# EAGLE design rotor (EAGLE 9.6.2)
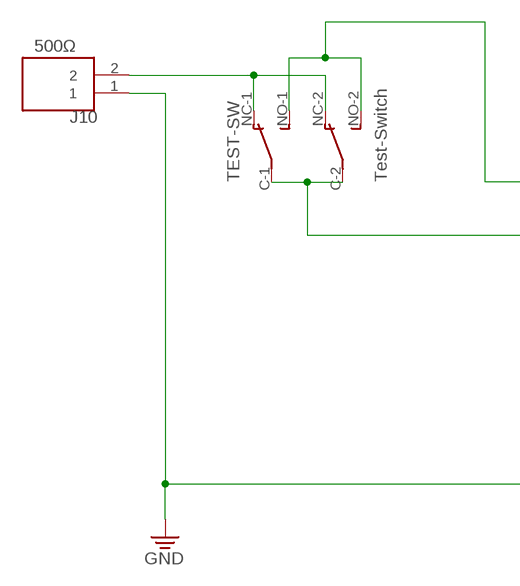
[diagram p0: schematic, sheet 1, part 1 of 2]
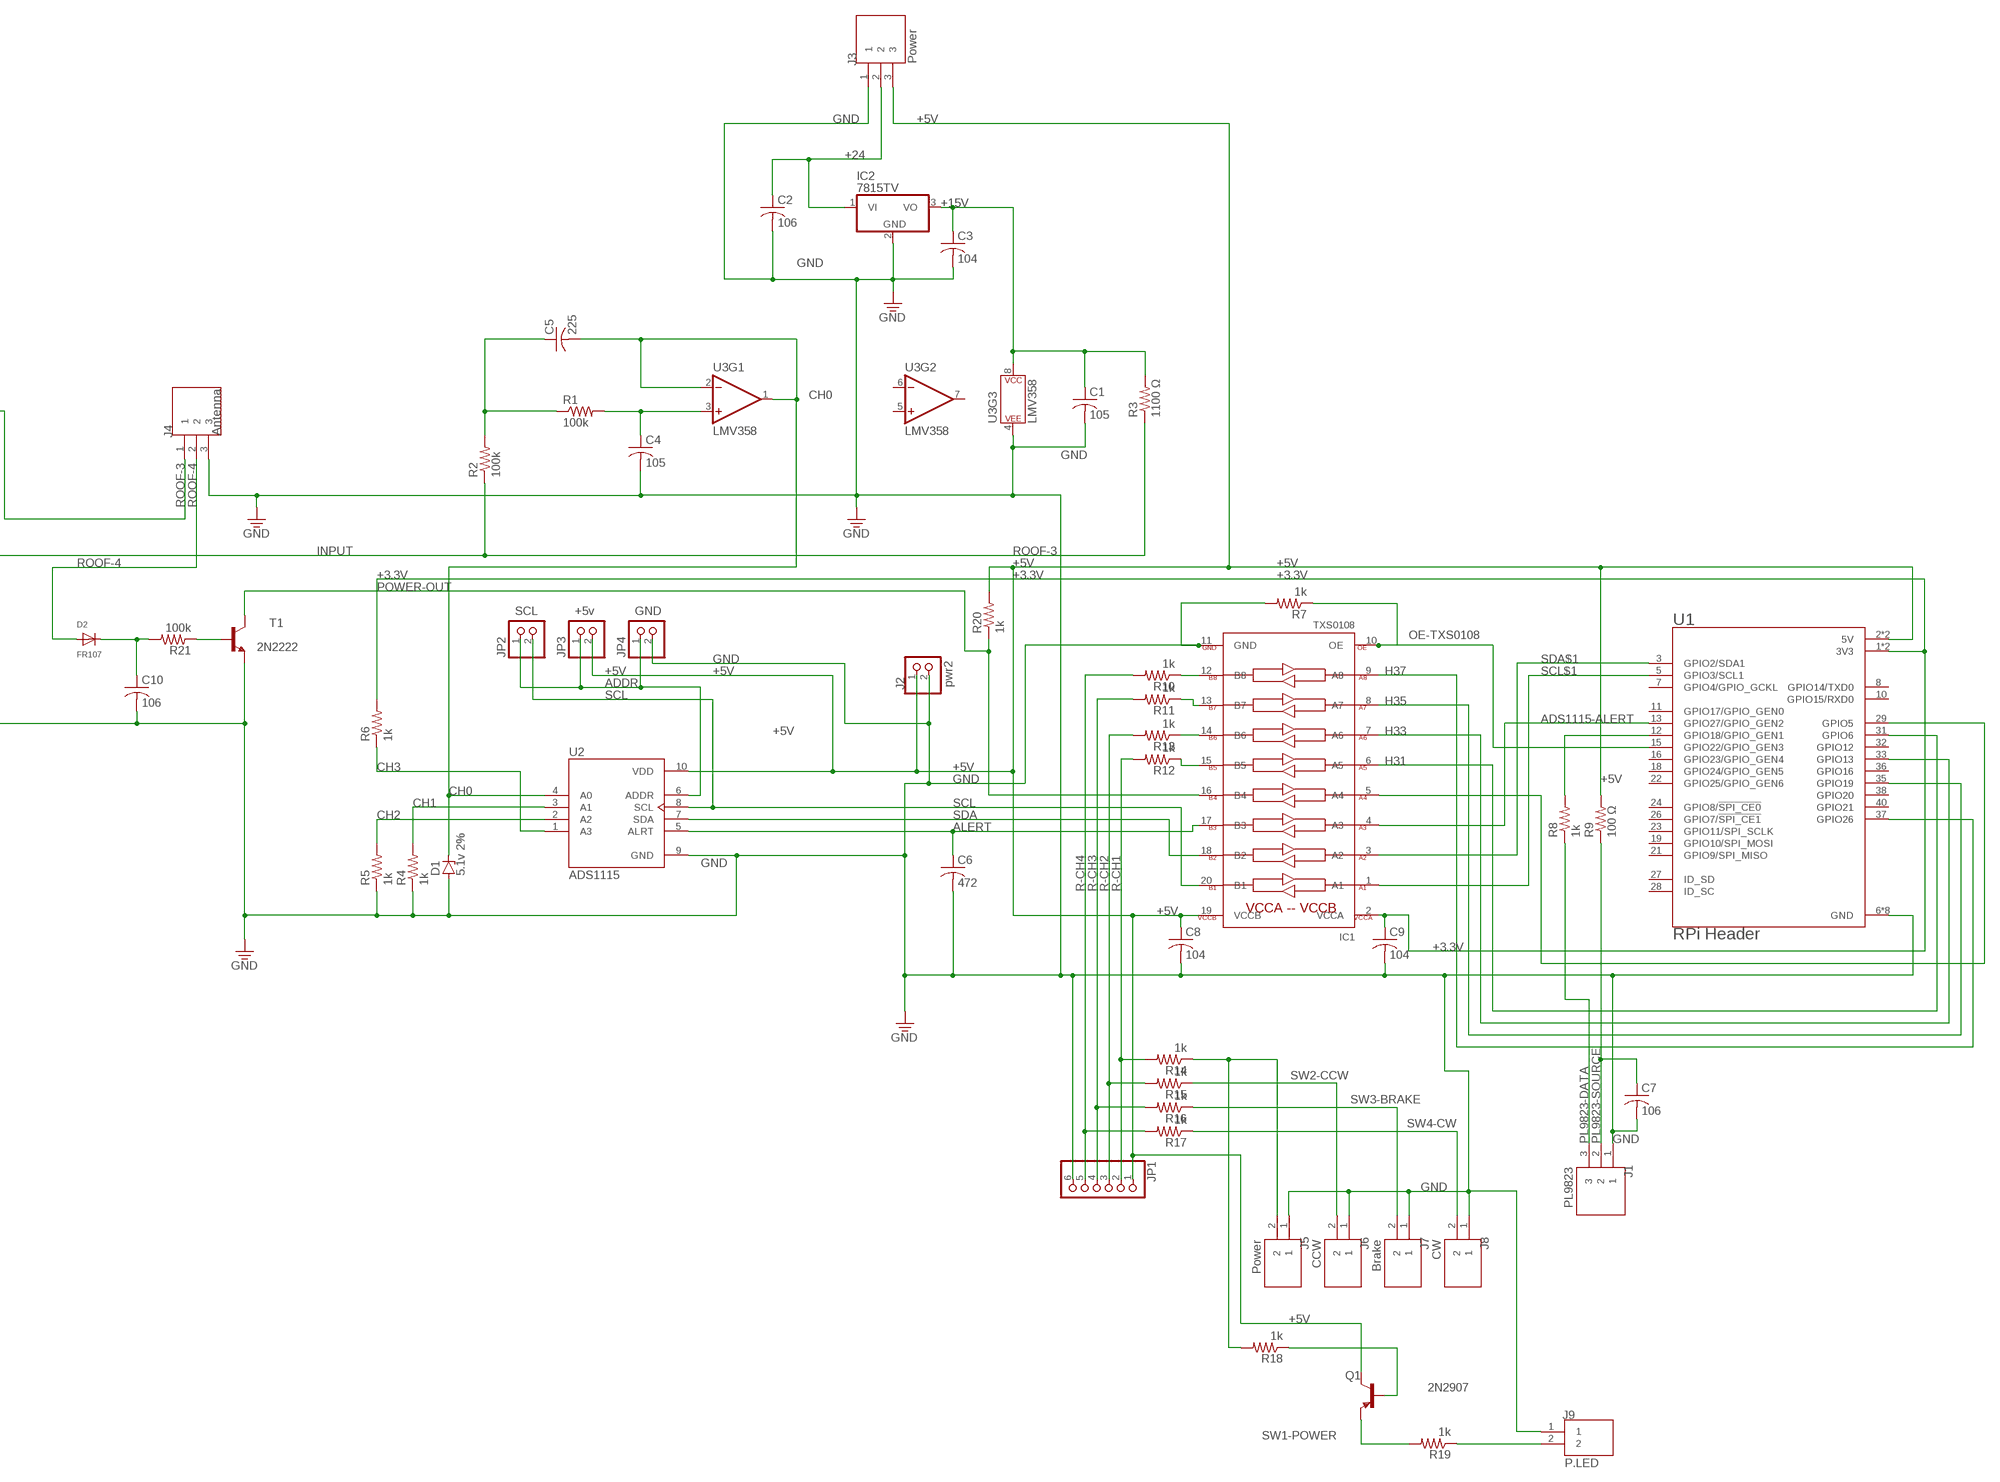
[diagram p1: schematic, sheet 1, part 2 of 2]

## Parts
C1  105  C-USC0805  [C0805]
C2  106  C-USC0805  [C0805]
C3  104  C-USC0805  [C0805]
C4  105  C-USC0805  [C0805]
C5  225  C-USC0805  [C0805]
C6  472  C-USC0805  [C0805]
C7  106  C-USC0805  [C0805]
C8  104  C-USC0805  [C0805]
C9  104  C-USC0805  [C0805]
C10  106  C-USC0805  [C0805]
D1  5.1v 2%  ZENER-DIODEZD-7.5  [ZDIO-7.5]
D2  FR107  DIODESMA  [SMADIODE]
IC1  TXS0108  TXS0108EPWR  [TSSOP20]
IC2  7815TV  [TO220V]
J1  PL9823  TB004-508-03BE  [CUI_TB004-508-03BE]
J2  pwr2  PINHD-1X2  [1X02]
J3  Power  TB004-508-03BE  [CUI_TB004-508-03BE]
J4  Antenna  TB004-508-03BE  [CUI_TB004-508-03BE]
J5  Power  TB004-508-02BE  [CUI_TB004-508-02BE]
J6  CCW  TB004-508-02BE  [CUI_TB004-508-02BE]
J7  Brake  TB004-508-02BE  [CUI_TB004-508-02BE]
J8  CW  TB004-508-02BE  [CUI_TB004-508-02BE]
J9  P.LED  TB004-508-02BE  [CUI_TB004-508-02BE]
J10  500Ω ├  TB004-508-02BE  [CUI_TB004-508-02BE]
JP1  PINHD-1X6  [1X06]
JP2  SCL  PINHD-1X2SPECIAL  [1X02-SPECIAL]
JP3  +5v  PINHD-1X2SPECIAL  [1X02-SPECIAL]
JP4  GND  PINHD-1X2SPECIAL  [1X02-SPECIAL]
Q1  2N2907  2N2907CBE  [TO92-CBE-OVAL]
R1  100k  R-US_M0805  [M0805]
R2  100k  R-US_M0805  [M0805]
R3  1100 Ω  R-US_M0805  [M0805]
R4  1k  R-US_M0805  [M0805]
R5  1k  R-US_M0805  [M0805]
R6  1k  R-US_M0805  [M0805]
R7  1k  R-US_M0805  [M0805]
R8  1k  R-US_M0805  [M0805]
R9  100 Ω  R-US_M0805  [M0805]
R10  1k  R-US_M0805  [M0805]
R11  1k  R-US_M0805  [M0805]
R12  1k  R-US_M0805  [M0805]
R13  1k  R-US_M0805  [M0805]
R14  1k  R-US_M0805  [M0805]
R15  1k  R-US_M0805  [M0805]
R16  1k  R-US_M0805  [M0805]
R17  1k  R-US_M0805  [M0805]
R18  1k  R-US_M0805  [M0805]
R19  1k  R-US_M0805  [M0805]
R20  1k  R-US_M0805  [M0805]
R21  100k  R-US_M0805  [M0805]
T1  2N2222  2N2222CBE  [TO92-CBE-OVAL]
TEST-SW  Test-Switch  DPDT-SWITCH  [DP-DT]
U1  RPi Header  RASPBERRY_PI_3B+_HDRMODEL_RASPBEERY_PI_3B_HDR  [MODULE_RASPBERRY_PI_3B+_HDR]
U2  ADS1115  ADS1115-BREAKOUT-NARROW  [MODULE_1115_NARROW]
U3  LMV358  LM358-SOP8SOIC  [SO08]

## Nets
+3.3V: C9.1 IC1.2(VCCA) R6.2 U1.1(3V3) U1.17(3V3)
+5V: C8.1 IC1.19(VCCB) J2.1 J3.3 JP1.1 JP3.2 Q1.C R9.2 R20.2 U1.2(5V) U1.4(5V) U2.10(VDD)
+15V: C1.1 C3.1 IC2.3(VO) R3.2 U3.8(P$V+)
+24: C2.1 IC2.1(VI) J3.2
ADDR: JP2.1 JP3.1 JP4.1 U2.6(ADDR)
ADS1115-ALERT: IC1.4(A3) U1.13(GPIO27/GPIO_GEN2)
ALERT: C6.1 IC1.17(B3) U2.5(ALRT)
CH0: C5.2 D1.C U2.4(A0) U3.1(OUT) U3.2(-IN)
CH1: R4.2 U2.3(A1)
CH2: R5.2 U2.2(A2)
CH3: R6.1 U2.1(A3)
GND: C1.2 C2.2 C3.2 C4.2 C6.2 C7.2 C8.2 C9.2 C10.2 D1.A IC1.11(GND) IC2.2(GND) J1.1 J2.2 J3.1 J4.3 J5.1 J6.1 J7.1 J8.1 J9.1 J10.1 JP1.6 JP4.2 R4.1 R5.1 R7.2 T1.E U1.6(GND) U1.9(GND) U1.14(GND) U1.20(GND) U1.25(GND) U1.30(GND) U1.34(GND) U1.39(GND) U2.9(GND) U3.4(P$V-)
H31: IC1.6(A5) U1.31(GPIO6)
H33: IC1.7(A6) U1.33(GPIO13)
H35: IC1.8(A7) U1.35(GPIO19)
H37: IC1.9(A8) U1.37(GPIO26)
INPUT: R2.1 R3.1 TEST-SW.C-1 TEST-SW.C-2
N$1: C4.1 R1.2 U3.3(+IN)
N$2: R8.2 U1.12(GPIO18/GPIO_GEN1)
N$3: C5.1 R1.1 R2.2
N$4: IC1.15(B5) R12.1
N$5: IC1.14(B6) R13.1
N$6: IC1.13(B7) R11.1
N$7: IC1.12(B8) R10.1
N$8: Q1.E R19.2
N$9: Q1.B R18.1
N$10: IC1.5(A4) U1.29(GPIO5)
N$11: C10.1 D2.C R21.2
N$12: R21.1 T1.B
N$14: J10.2 TEST-SW.NC-1 TEST-SW.NC-2
OE-TXS0108: IC1.10(OE) R7.1 U1.15(GPIO22/GPIO_GEN3)
PL9823-DATA: J1.3 R8.1
PL9823-SOURCE: C7.1 J1.2 R9.1
POWER-OUT: IC1.16(B4) R20.1 T1.C
R-CH1: JP1.2 R12.2 R14.2
R-CH2: JP1.3 R13.2 R15.2
R-CH3: JP1.4 R11.2 R16.2
R-CH4: JP1.5 R10.2 R17.2
ROOF-3: J4.1 TEST-SW.NO-1 TEST-SW.NO-2
ROOF-4: D2.A J4.2
ROTOR-PWR-LED-SOURCE: J9.2 R19.1
SCL: IC1.20(B1) JP2.2 U2.8(SCL)
SCL$1: IC1.1(A1) U1.5(GPIO3/SCL1)
SDA: IC1.18(B2) U2.7(SDA)
SDA$1: IC1.3(A2) U1.3(GPIO2/SDA1)
SW1-POWER: J5.2 R14.1 R18.2
SW2-CCW: J6.2 R15.1
SW3-BRAKE: J7.2 R16.1
SW4-CW: J8.2 R17.1
Unconnected: U1.7(GPIO4/GPIO_GCKL) U1.8(GPIO14/TXD0) U1.10(GPIO15/RXD0) U1.11(GPIO17/GPIO_GEN0) U1.16(GPIO23/GPIO_GEN4) U1.18(GPIO24/GPIO_GEN5) U1.19(GPIO10/SPI_MOSI) U1.21(GPIO9/SPI_MISO) U1.22(GPIO25/GPIO_GEN6) U1.23(GPIO11/SPI_SCLK) U1.24(GPIO8/!SPI_CE0!) U1.26(GPIO7/!SPI_CE1!) U1.27(ID_SD) U1.28(ID_SC) U1.32(GPIO12) U1.36(GPIO16) U1.38(GPIO20) U1.40(GPIO21) U3.5(+IN) U3.6(-IN) U3.7(OUT)

## Library data of the parts
C1-C10 = test:C-US: CAPACITOR, American symbol
D1 = diode:ZENER-DIODE: Z-Diode
D2 = test:DIODE: Diode SMADIODE - SMA Surface Mount Package 20V 1A Schottky Diode Digikey: 641-1014-6-ND DO-1N4148 - Through Hole Small Current Diode SOD-123 20V 1 A (.5mV Vf) Schottky Diode - Digikey: MBRX120TPMSCT-ND SOD-323 10V 570mA (.38mV Vf, 3ns) Schottky Diode - Digikey: ZLLS410CT-ND SOD-523 30V 30mA Schottky Diode (RB751S-40TE61) - Digikey: RB751S-40TE61CT-ND SOT23-R/W - SOT23 Package (R = Solder Paste/Reflow Ovens, W = Hand-Soldering) BAT54Film 40V 300mA - Digikey: 497-7162-1-ND
IC1 = txs0108e:TXS0108E: TI TXS0108E Pegelwandler Check availability <https://pricing.snapeda.com/parts/TXS0108E/Texas%20Instruments/view-part?ref=eda>; AVAILABILITY: In Stock; DESCRIPTION: Voltage Level Translator Bidirectional 1 Circuit 8 Channel 60Mbps 20-VQFN (3.5x4.5); MF: Texas Instruments; MP: TXS0108E; PACKAGE: None; PRICE: None; PURCHASE-URL: https://pricing.snapeda.com/search/part/TXS0108E/?ref=eda
IC2 = linear:78*: Positive VOLTAGE REGULATOR Source: http://cache.national.com/ds/LM/LM78L05.pdf http://www.fairchildsemi.com/ds/LM/LM7805.pdf
J1 J3 J4 = TB004-508-03BE:TB004-508-03BE: Screw Terminal 5.08 pitch Check availability <https://pricing.snapeda.com/parts/TB004%20-508-03BE/CUI%20Devices/view-part?ref=eda>; AVAILABILITY: In Stock; CUI_PURCHASE_URL: https://www.cuidevices.com/product/interconnect/connectors/terminal-blocks/tb004-508-series?utm_source=snapeda.com&utm_medium=referral&utm_campaign=snapedaBOM; DESCRIPTION: 2~24 Poles, Screw Type, Horizontal, 5.08 Pitch, 24~12 (AWG), Terminal Block Connector; MF: CUI Devices; MP: TB004 -508-03BE; PACKAGE: None; PRICE: None; PURCHASE-URL: https://pricing.snapeda.com/search/part/TB004 -508-03BE/?ref=eda
J2 JP2-JP4 = pinhead:PINHD-1X2: PIN HEADER
J5-J10 = TB004-508-02BE:TB004-508-02BE: Screw Terminal 5.08 pitch Check availability <https://pricing.snapeda.com/parts/TB004-508-02BE/CUI%20Devices/view-part?ref=eda>; AVAILABILITY: In Stock; CUI_PURCHASE_URL: https://www.cuidevices.com/product/interconnect/connectors/terminal-blocks/tb004-508-series?utm_source=snapeda.com&utm_medium=referral&utm_campaign=snapedaBOM; DESCRIPTION: 2~24 Poles, Screw Type, Horizontal, 5.08 Pitch, 24~12 (AWG), Terminal Block Connector; MF: CUI Devices; MP: TB004-508-02BE; PACKAGE: None; PRICE: None; PURCHASE-URL: https://pricing.snapeda.com/search/part/TB004-508-02BE/?ref=eda
JP1 = pinhead:PINHD-1X6: PIN HEADER
Q1 = test:2N2907*: PNP Transistor Big Oval pads
R1 R2 R4-R21 = test:R-US_: RESISTOR, American symbol
R3 = ladyada:R-US_: RESISTOR, American symbol
T1 = test:2N2222: NPN TRANSISTOR Big oval pads
TEST-SW = ladyada:DPDT-SWITCH
U1 = raspberry_pi_3b:RASPBERRY_PI_3B+_HDR: Check availability <https://pricing.snapeda.com/parts/RASPBERRY%20PI%203%20MODEL%20B%2B/Raspberry%20Pi/view-part?ref=eda>
U2 = ads1115breakout-narrow:ADS1115-BREAKOUT-NARROW: ADS1115 - 16 Bit 860 Samples per Second Analog to Digital Converter (ADC) Evaluation Board Check availability <https://pricing.snapeda.com/parts/1085/Adafruit%20Industries/view-part?ref=eda>; AVAILABILITY: In Stock; DESCRIPTION: ADS1115 series 16 Bit 860 Samples per Second Analog to Digital Converter (ADC) Evaluation Board; MF: Adafruit Industries; MP: 1085; PACKAGE: None; PRICE: None; PURCHASE-URL: https://pricing.snapeda.com/search/part/1085/?ref=eda
U3 = SparkFun-IC-Amplifiers:LM358-SOP8: IC LMV358 DUAL OP AMP Jellybean rail-to-rail output op-amp SparkFun Products SparkFun PicoBoard <https://www.sparkfun.com/products/11888> (WIG-11888) SparkFun Vernier Interface Shield <https://www.sparkfun.com/products/12858> (DEV-12858) SparkFun Blynk Board - ESP8266 <https://www.sparkfun.com/products/13794> (WRL-13794) SparkFun Digital Sandbox <https://www.sparkfun.com/products/12651> (DEV-12651 RoHS); PROD_ID: IC-09657

## Board
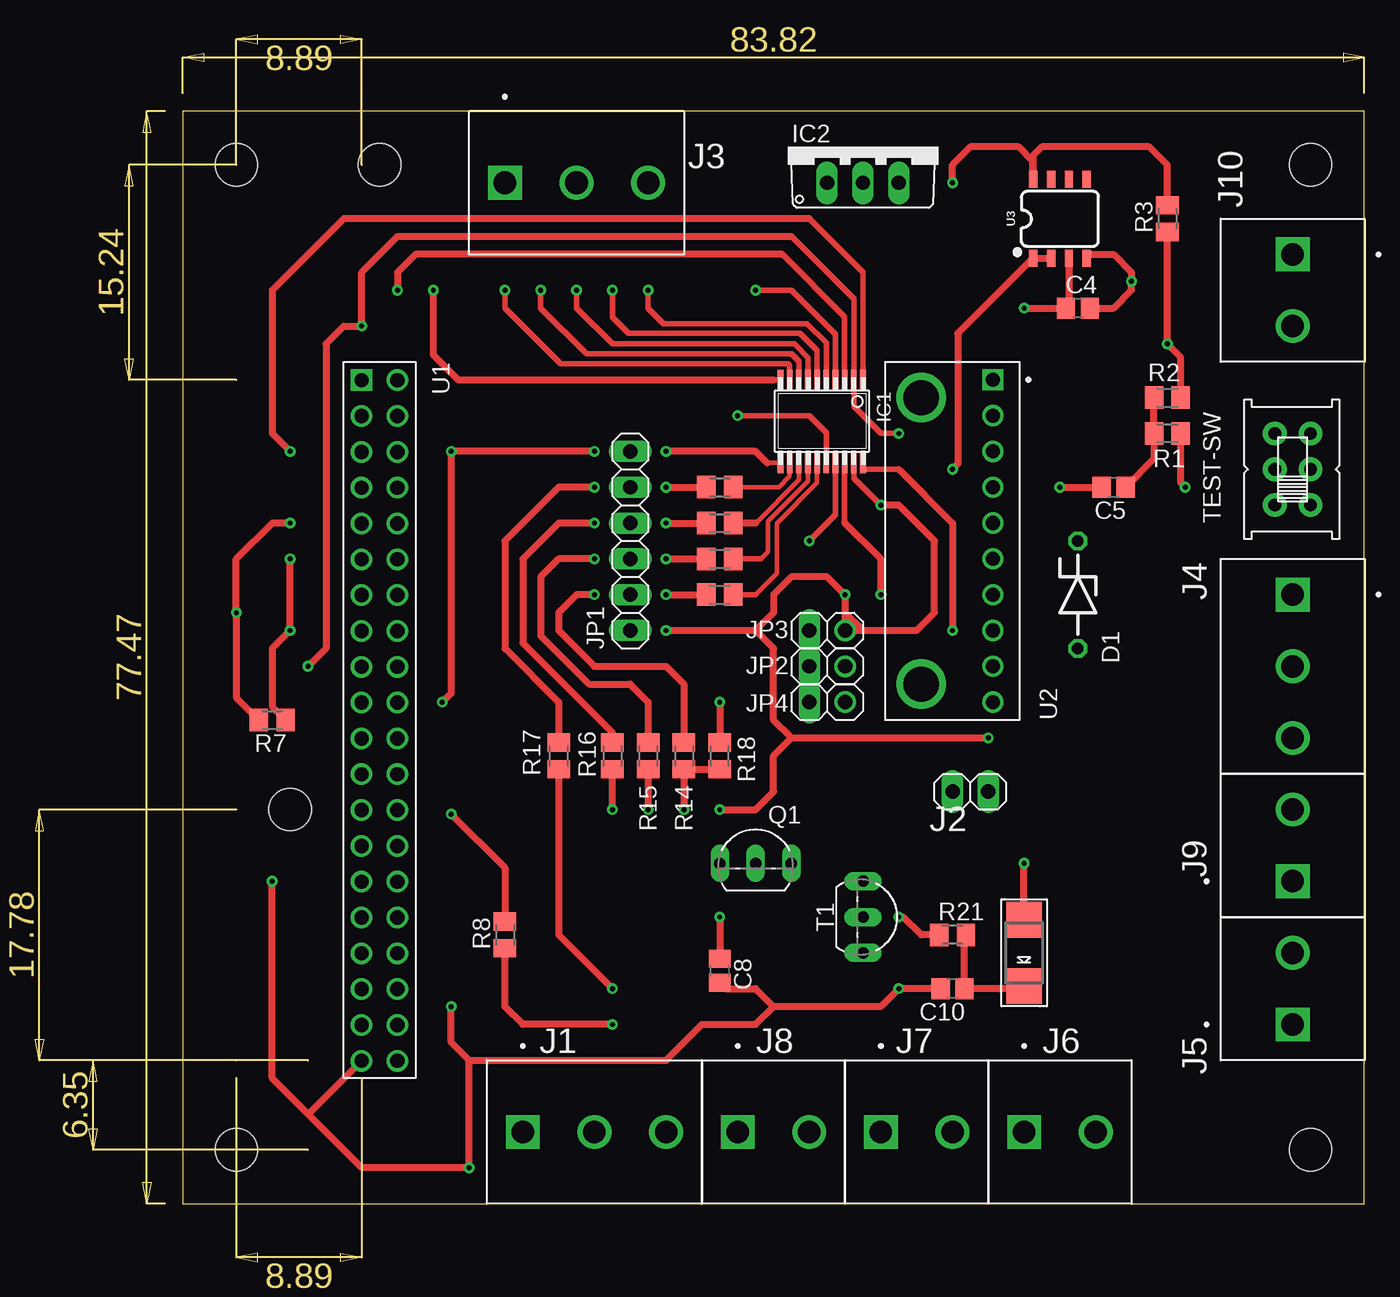
[diagram p2: board, top side]
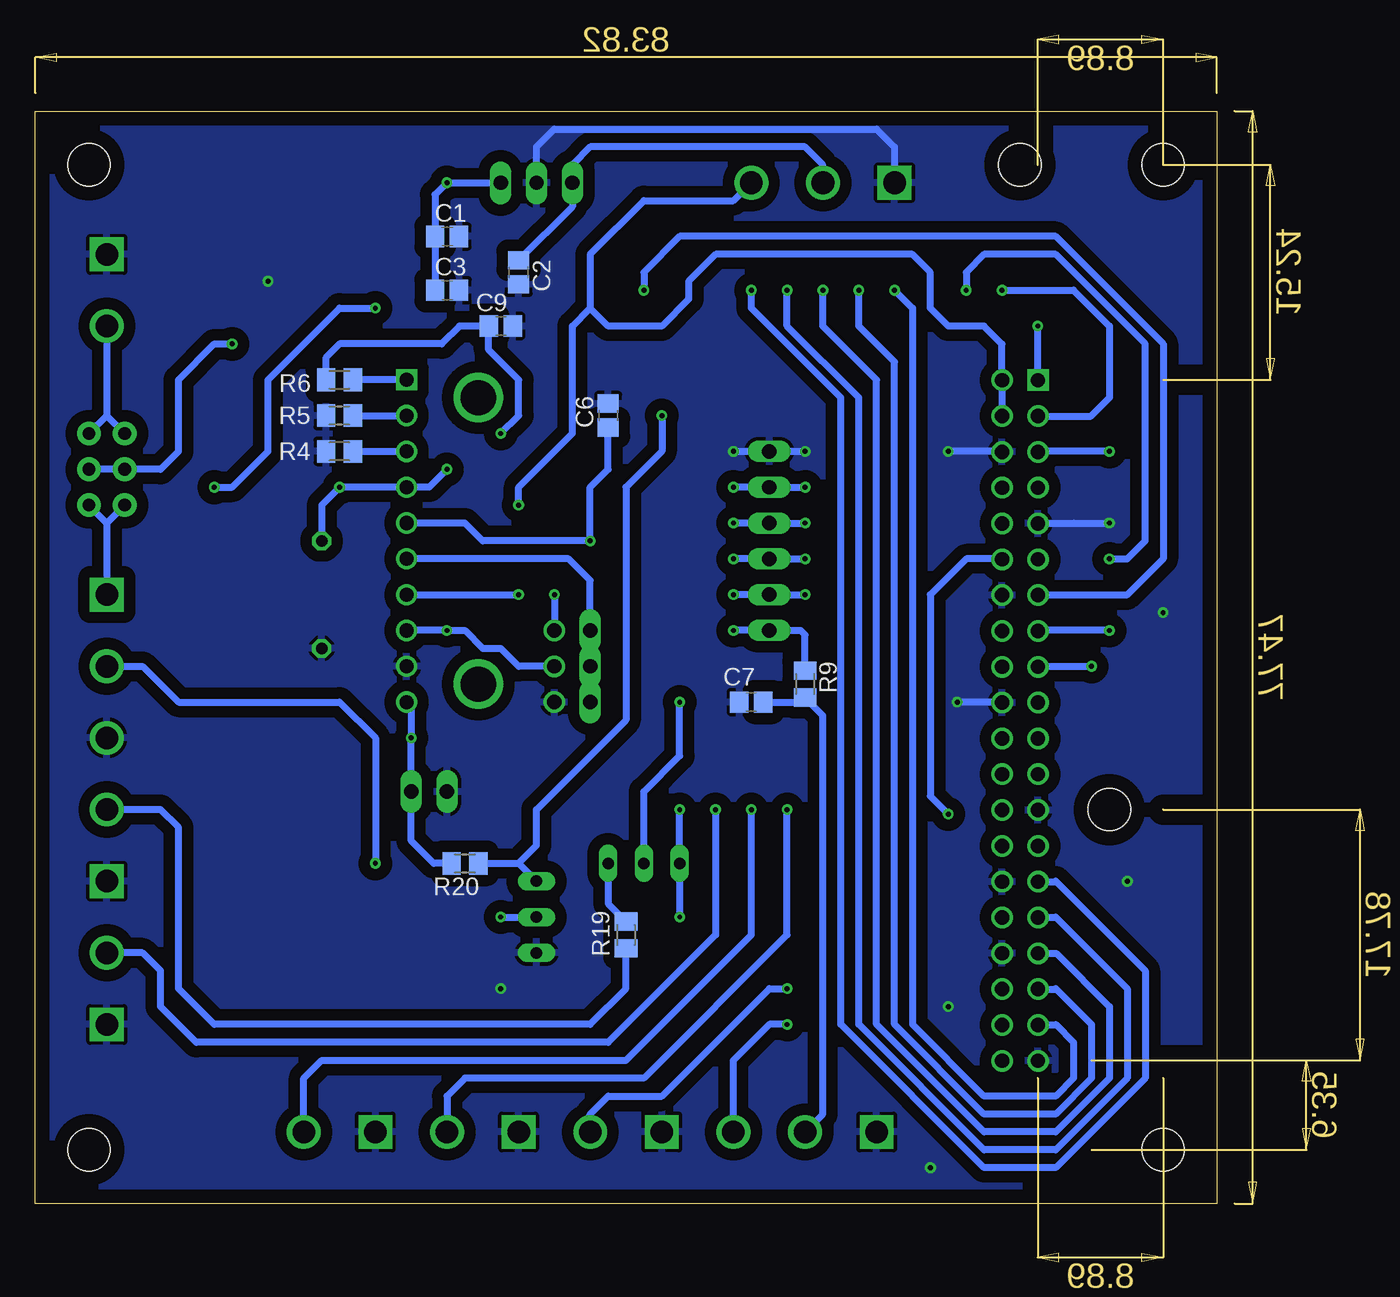
[diagram p3: board, bottom side, seen from below]

Size 83.82 x 77.47 mm. Coordinates in mm from the lower left corner, seen from the top.
Outline: 0,0 83.82,0 83.82,77.47 0,77.47 0,0
Copper layers (1*16): Top 0.035mm / dielectric 1.5mm / Bottom 0.035mm
Design rules "default": minimum track width 6mil, minimum drill 0.35mm, track to track 6mil, track to pad 6mil, pad to pad 6mil, via to via 6mil, smd to smd 6mil, copper to edge 40mil, drill to drill 6mil, minimum pad ring 10mil, minimum via ring 8mil, stop-mask expansion 4mil, vias tented up to drill 0mil, thermal gap 10mil
Holes 3 mm at 80.01,73.66 3.81,73.66 3.81,3.81 80.01,3.81 7.62,27.94 13.97,73.66

### Footprints (pad centres in the part's own frame; a part is rotated, then mirrored left to right if it is on the bottom)
C0805 = smd 1.3 x 1.5: 1 -0.85,0; 2 0.85,0
ZDIO-7.5 = drill 0.813 octagon: A 3.81,0; C -3.81,0
SMADIODE = smd 2.54 x 2.54: A 2.349,0; C -2.349,0
TSSOP20 = smd 0.4 x 1.45: 1 0,0; 2 0.65,0; 3 1.3,0; 4 1.95,0; 5 2.6,0; 6 3.25,0; 7 3.9,0; 8 4.55,0; 9 5.2,0; 10 5.85,0; 11 5.85,5.9; 12 5.2,5.9; 13 4.55,5.9; 14 3.9,5.9; 15 3.25,5.9; 16 2.6,5.9; 17 1.95,5.9; 18 1.3,5.9; 19 0.65,5.9; 20 0,5.9
TO220V = drill 1.016 long: 1 -2.54,-2.54; 2 0,-2.54; 3 2.54,-2.54
CUI_TB004-508-03BE = drill 1.6 square: 1 0,0 | drill 1.6: 2 5.08,0; 3 10.16,0
1X02 = drill 1.016 long: 1 -1.27,0; 2 1.27,0
CUI_TB004-508-02BE = drill 1.6 square: 1 0,0 | drill 1.6: 2 5.08,0
1X06 = drill 1.016 long: 1 -6.35,0; 2 -3.81,0; 3 -1.27,0; 4 1.27,0; 5 3.81,0; 6 6.35,0
1X02-SPECIAL = drill 1.016 long: 1 -1.27,0 | drill 1.016: 2 1.27,0
TO92-CBE-OVAL = drill 0.813 long: B 0,-1.27; C -2.54,-1.27; E 2.54,-1.27
M0805 = smd 1.3 x 1.6: 1 -0.95,0; 2 0.95,0
DP-DT = drill 0.9 pad 1.676: C-1 0,-1.27; C-2 0,1.27; NC-1 2.54,-1.27; NC-2 2.54,1.27; NO-1 -2.54,-1.27; NO-2 -2.54,1.27
MODULE_RASPBERRY_PI_3B+_HDR = drill 1.016 square: 1 0.033,-0.011 | drill 1.016: 2 0.033,2.529; 3 2.573,-0.011; 4 2.573,2.529; 5 5.113,-0.011; 6 5.113,2.529; 7 7.653,-0.011; 8 7.653,2.529; 9 10.193,-0.011; 10 10.193,2.529; 11 12.733,-0.011; 12 12.733,2.529; 13 15.273,-0.011; 14 15.273,2.529; 15 17.813,-0.011; 16 17.813,2.529; 17 20.353,-0.011; 18 20.353,2.529; 19 22.893,-0.011; 20 22.893,2.529; 21 25.433,-0.011; 22 25.433,2.529; 23 27.973,-0.011; 24 27.973,2.529; 25 30.513,-0.011; 26 30.513,2.529; 27 33.053,-0.011; 28 33.053,2.529; 29 35.593,-0.011; 30 35.593,2.529; 31 38.133,-0.011; 32 38.133,2.529; 33 40.673,-0.011; 34 40.673,2.529; 35 43.213,-0.011; 36 43.213,2.529; 37 45.753,-0.011; 38 45.753,2.529; 39 48.293,-0.011; 40 48.293,2.529
MODULE_1115_NARROW = drill 1 square: 1 11.43,-6.668 | drill 1: 2 8.89,-6.668; 3 6.35,-6.668; 4 3.81,-6.668; 5 1.27,-6.668; 6 -1.27,-6.668; 7 -3.81,-6.668; 8 -6.35,-6.668; 9 -8.89,-6.668; 10 -11.43,-6.668 | drill 2.5: P1 -10.16,-1.587; P2 10.16,-1.587
SO08 = smd 0.6 x 1.2: 1 -1.905,-2.8; 2 -0.635,-2.8; 3 0.635,-2.8; 4 1.905,-2.8; 5 1.905,2.8; 6 0.635,2.8; 7 -0.635,2.8; 8 -1.905,2.8

### Placement (x,y rotation side)
C1  54.61,68.58 0 bottom
C2  49.53,66.04 270 bottom
C3  54.61,64.77 0 bottom
C4  63.5,63.5 0 top
C5  66.04,50.8 180 top
C6  43.18,55.88 90 bottom
C7  33.02,35.56 180 bottom
C8  38.1,16.51 270 top
C9  50.8,62.23 0 bottom
C10  54.61,15.24 180 top
D1  63.5,43.18 270 top
D2  59.69,17.78 90 top
IC1  48.26,58.42 180 top
IC2  48.26,74.93 0 top
J1  24.13,5.08 0 top
J2  55.88,29.21 180 top
J3  22.86,72.39 0 top
J4  78.74,43.18 270 top
J5  78.74,12.7 90 top
J6  59.69,5.08 0 top
J7  49.53,5.08 0 top
J8  39.37,5.08 0 top
J9  78.74,22.86 90 top
J10  78.74,67.31 270 top
JP1  31.75,46.99 90 top
JP2  45.72,38.1 0 top
JP3  45.72,40.64 0 top
JP4  45.72,35.56 0 top
Q1  40.64,25.4 0 top
R1  69.85,54.61 0 top
R2  69.85,57.15 180 top
R3  69.85,69.85 90 top
R4  62.23,53.34 0 bottom
R5  62.23,55.88 0 bottom
R6  62.23,58.42 180 bottom
R7  6.35,34.29 180 top
R8  22.86,19.05 90 top
R9  29.21,36.83 90 bottom
R10  38.1,50.8 180 top
R11  38.1,48.26 180 top
R12  38.1,43.18 180 top
R13  38.1,45.72 180 top
R14  35.56,31.75 90 top
R15  33.02,31.75 90 top
R16  30.48,31.75 90 top
R17  26.67,31.75 90 top
R18  38.1,31.75 270 top
R19  41.91,19.05 90 bottom
R20  53.34,24.13 180 bottom
R21  54.61,19.05 0 top
T1  49.53,20.32 270 top
TEST-SW  78.74,52.07 90 top
U1  12.7,58.42 270 top
U2  50.8,46.99 90 top
U3  62.23,69.85 0 top

### Tracks (layer width: path | path; a pad name or v marks a point on that pad's centre or on a via)
+3.3V  (via drill 0.35)
  Top 0.406: 43.18,68.58 47.61,64.15 IC1.2 47.61,56.53 49.53,54.61 v50.8,54.61
  Top 0.508: 43.18,68.58 15.24,68.58 12.7,66.04 v12.7,62.23 11.43,62.23 10.16,60.96 10.16,39.37 v8.89,38.1
  Bottom 0.508: R6.2 63.18,60.01 62.23,60.96 54.99,60.96 53.72,62.23 C9.1 51.65,60.54 49.53,58.42 49.53,55.88 v50.8,54.61 | v8.89,38.1 8.89,38.07 U1.17 | U1.1 v12.69,62.22 v12.7,62.23
+5V  (via drill 0.35)
  Top 0.406: IC1.19 47.61,51.45 v49.53,49.53
  Top 0.508: 43.18,33.02 41.91,34.29 41.91,39.37 40.64,40.64 | 43.18,33.02 v57.15,33.02 | 48.26,40.64 JP3.2 46.99,41.91 | 48.26,40.64 52.07,40.64 53.34,41.91 53.34,46.99 50.8,49.53 v49.53,49.53 | 46.99,41.91 v46.99,43.18 45.72,44.45 43.18,44.45 41.91,43.18 41.91,41.91 40.64,40.64 | 46.99,41.91 48.26,40.64 | v34.29,40.64 40.64,40.64 | v38.1,27.94 40.64,27.94 41.91,29.21 41.91,31.75 43.18,33.02 | v38.1,20.32 C8.1
  Bottom 0.508: U1.4 U1.2 15.23,60.95 16.51,62.23 19.05,62.23 20.32,63.5 20.32,66.04 21.59,67.31 35.56,67.31 37.47,65.41 37.47,64.14 39.37,62.23 43.18,62.23 44.45,63.5 | v49.53,49.53 49.53,50.8 45.72,54.61 45.72,62.23 44.45,63.5 | U2.10 57.15,35.24 v57.15,33.02 J2.1 57.15,25.72 55.56,24.13 R20.2 | 44.45,63.5 44.45,67.31 40.64,71.12 34.29,71.12 J3.3 | v34.29,40.64 JP1.1 29.53,40.64 29.21,40.32 R9.2 | v38.1,27.94 Q1.C v38.1,20.32 | v46.99,43.18 JP3.2
+15V  (via drill 0.35)
  Top 0.508: v54.61,72.39 54.61,73.66 55.88,74.93 59.31,74.93 60.33,73.92 U3.8 60.33,74.3 60.96,74.93 68.58,74.93 69.85,73.66 R3.2
  Bottom 0.508: C3.1 C1.1 55.46,71.54 v54.61,72.39 IC2.3
+24
  Bottom 0.508: C2.1 45.72,70.7 IC2.1 45.72,73.66 44.45,74.93 29.21,74.93 27.94,73.66 J3.2
ADDR
  Bottom 0.508: JP2.1 JP4.1 JP3.1 44.45,44.2 45.97,45.72 U2.6
ADS1115-ALERT  (via drill 0.35)
  Top 0.406: IC1.4 46.31,61.64 43.18,64.77 v40.64,64.77
  Bottom 0.508: v40.64,64.77 40.64,66.04 38.1,68.58 11.43,68.58 3.81,60.96 3.81,45.72 6.38,43.15 U1.13
ALERT  (via drill 0.35)
  Top 0.406: IC1.17 46.31,48.85 v44.45,46.99
  Bottom 0.508: U2.5 53.34,48.26 52.07,46.99 v44.45,46.99 44.45,50.8 43.18,52.07 C6.1
CH0  (via drill 0.35)
  Top 0.508: U3.2 U3.1 54.99,61.72 54.99,52.45 v54.61,52.07 | v62.23,50.8 C5.2
  Bottom 0.508: D1.C 63.5,49.53 v62.23,50.8 U2.4 55.88,50.8 v54.61,52.07
CH1
  Bottom 0.508: R4.2 U2.3
CH2
  Bottom 0.508: R5.2 U2.2
CH3
  Bottom 0.508: U2.1 R6.1
GND  (via drill 0.35)
  Top 0.305: IC1.11 41.46,52.52
  Top 0.508: 41.46,52.52 40.64,53.34 v34.29,53.34 | v29.21,53.34 v19.05,53.34 19.05,36.2 v18.41,35.56 | v7.62,48.26 6.35,48.26 3.81,45.72 v3.81,41.91 3.81,35.88 R7.2 | 20.32,10.16 v20.32,2.54 12.7,2.54 8.89,6.35 | 20.32,10.16 34.29,10.16 36.83,12.7 40.64,12.7 41.91,13.97 | C10.2 v50.8,15.24 49.53,13.97 41.91,13.97 | C8.2 38.52,15.24 40.64,15.24 41.91,13.97 | 8.89,6.35 6.35,8.89 v6.35,22.86 | 20.32,10.16 19.05,11.43 v19.05,13.97 | C4.2 66.04,63.5 67.31,64.77 v67.31,65.41 67.31,66.04 66.04,67.31 64.39,67.31 U3.4 | U1.39 8.91,6.35 8.89,6.35
  Bottom 0.152: 15.21,17.75 U1.34
  Bottom 0.508: v34.29,53.34 JP1.6 v29.21,53.34 | U1.9 10.19,48.23 10.16,48.26 v7.62,48.26 | IC2.2 48.26,74.93 47,76.19 24.13,76.19 22.86,74.92 J3.1 | U1.6 15.26,53.34 v19.05,53.34 | U1.20 15.26,35.56 v18.41,35.56
  pour Bottom (isolate 0.813): 0,0 0,77.47 83.82,77.47 83.82,0
H31  (via drill 0.35)
  Top 0.406: IC1.6 45.01,60.51 43.8,61.72 31.62,61.72 30.48,62.87 v30.48,64.77
  Bottom 0.508: U1.31 11.46,20.29 11.43,20.32 6.35,15.24 6.35,8.89 11.43,3.81 16.51,3.81 25.4,12.7 25.4,57.15 30.48,62.23 v30.48,64.77
H33  (via drill 0.35)
  Top 0.406: IC1.7 44.36,59.99 43.39,60.96 30.48,60.96 27.94,63.5 v27.94,64.77
  Bottom 0.508: U1.33 11.4,17.75 7.62,13.97 7.62,8.89 11.43,5.08 16.51,5.08 24.13,12.7 24.13,58.42 27.94,62.23 v27.94,64.77
H35  (via drill 0.35)
  Top 0.406: IC1.8 43.71,59.72 43.18,60.25 28.65,60.25 25.4,63.5 v25.4,64.77
  Bottom 0.508: U1.35 11.46,15.21 11.43,15.24 8.89,12.7 8.89,8.89 11.43,6.35 16.51,6.35 22.86,12.7 22.86,59.69 25.4,62.23 v25.4,64.77
H37  (via drill 0.35)
  Top 0.406: IC1.9 43.06,59.45 42.95,59.56 26.8,59.56 22.86,63.5 v22.86,64.77
  Bottom 0.508: U1.37 11.46,12.67 11.43,12.7 10.16,11.43 10.16,8.89 11.43,7.62 16.51,7.62 21.59,12.7 21.59,63.5 v22.86,64.77
INPUT  (via drill 0.35)
  Top 0.508: R3.1 v69.85,60.96 70.8,60.01 R2.1
  Bottom 0.508: TEST-SW.C-1 TEST-SW.C-2 74.93,52.07 73.66,53.34 73.66,58.42 71.12,60.96 v69.85,60.96
N$1  (via drill 0.35)
  Top 0.508: v59.69,63.5 C4.1 62.87,63.72 U3.3 | v71.12,50.8 70.8,51.12 R1.2
  Bottom 0.508: v59.69,63.5 62.23,63.5 67.31,58.42 67.31,53.34 69.85,50.8 v71.12,50.8
N$2  (via drill 0.35)
  Top 0.508: v19.05,27.62 22.86,23.81 R8.2
  Bottom 0.508: U1.12 15.26,45.72 17.78,45.72 20.32,43.18 20.32,28.89 v19.05,27.62
N$3
  Top 0.508: R2.2 R1.1 68.9,52.81 C5.1
N$4
  Top 0.305: 40.64,43.18 42.16,44.7 42.16,48.26 45.01,51.11 IC1.15
  Top 0.406: 40.64,43.18 R12.1
N$5
  Top 0.305: IC1.14 44.36,51.22 41.53,48.39 41.53,46.23 41.02,45.72
  Top 0.406: 41.02,45.72 R13.1
N$6
  Top 0.305: IC1.13 43.71,51.32 40.65,48.26
  Top 0.508: 40.65,48.26 R11.1
N$7
  Top 0.305: IC1.12 43.06,51.57 42.29,50.8 R10.1
N$8
  Bottom 0.508: R19.2 43.18,21.27 Q1.E
N$9  (via drill 0.35)
  Top 0.508: v38.1,35.56 R18.1
  Bottom 0.508: Q1.B 40.64,29.21 38.1,31.75 v38.1,35.56
N$10  (via drill 0.35)
  Top 0.406: v33.02,64.77 33.02,63.5 34.11,62.41 44.28,62.41 45.66,61.03 IC1.5
  Bottom 0.508: U1.29 11.46,22.83 11.43,22.86 5.08,16.51 5.08,8.89 11.43,2.54 16.51,2.54 26.67,12.7 26.67,57.15 33.02,63.5 v33.02,64.77
N$11
  Top 0.508: D2.C 59.5,15.24 C10.1 55.46,18.95 R21.2
N$12  (via drill 0.35)
  Top 0.508: R21.1 52.39,19.05 51.12,20.32 v50.8,20.32
  Bottom 0.508: v50.8,20.32 T1.B
N$14
  Bottom 0.508: TEST-SW.NC-1 78.74,55.88 | 78.74,55.88 TEST-SW.NC-2 | J10.2 78.74,55.88
OE-TXS0108  (via drill 0.35)
  Top 0.406: 41.91,58.42 IC1.10
  Top 0.508: v17.78,64.77 17.78,60.19 19.55,58.42 41.91,58.42 | v7.62,45.72 v7.62,40.64 6.35,39.37 6.35,35.24 R7.1
  Bottom 0.508: 7.65,45.69 v7.62,45.72 6.35,45.72 5.08,46.99 5.08,60.96 11.43,67.31 16.51,67.31 17.78,66.04 v17.78,64.77 | v7.62,40.64 12.66,40.64 U1.15
PL9823-DATA  (via drill 0.35)
  Top 0.508: v30.48,12.7 24.13,12.7 22.86,13.97 R8.1
  Bottom 0.508: v30.48,12.7 31.75,12.7 34.29,10.16 J1.3
PL9823-SOURCE
  Bottom 0.508: R9.1 29.31,35.98 | J1.2 27.94,6.35 27.94,34.61 R9.1 | R9.1 29.21,35.56 C7.1
POWER-OUT  (via drill 0.35)
  Top 0.406: IC1.16 45.66,54.67 44.45,55.88 v39.37,55.88
  Bottom 0.508: v39.37,55.88 39.37,53.34 41.91,50.8 41.91,34.29 48.26,27.94 48.26,25.4 49.53,24.13 | R20.1 49.53,24.13 | 49.53,24.13 T1.C
R-CH1  (via drill 0.35)
  Top 0.508: v29.21,43.18 27.94,43.18 26.67,41.91 26.67,40.64 29.21,38.1 34.29,38.1 35.56,36.83 R14.2 | v34.29,43.18 R12.2
  Bottom 0.508: v29.21,43.18 JP1.2 v34.29,43.18
R-CH2  (via drill 0.35)
  Top 0.508: v29.21,45.72 26.67,45.72 25.4,44.45 25.4,40.26 28.83,36.83 31.75,36.83 33.02,35.56 R15.2 | v34.29,45.72 R13.2
  Bottom 0.508: v29.21,45.72 JP1.3 v34.29,45.72
R-CH3  (via drill 0.35)
  Top 0.508: v29.21,48.26 26.67,48.26 24.13,45.72 24.13,39.75 30.48,33.4 R16.2 | v34.29,48.26 R11.2
  Bottom 0.508: v29.21,48.26 JP1.4 v34.29,48.26
R-CH4  (via drill 0.35)
  Top 0.508: v29.21,50.8 26.67,50.8 22.86,46.99 22.86,39.37 26.67,35.56 R17.2 | v34.29,50.8 R10.2
  Bottom 0.508: v29.21,50.8 JP1.5 v34.29,50.8
ROOF-3
  Bottom 0.508: TEST-SW.NO-2 78.74,48.26 | TEST-SW.NO-1 78.74,48.26 | 78.74,48.26 J4.1
ROOF-4  (via drill 0.35)
  Top 0.508: D2.A v59.69,24.13
  Bottom 0.508: v59.69,24.13 59.69,33.02 62.23,35.56 73.66,35.56 76.2,38.1 J4.2
ROTOR-PWR-LED-SOURCE
  Bottom 0.508: J9.2 74.93,27.94 73.66,26.67 73.66,15.24 71.12,12.7 44.45,12.7 41.91,15.24 R19.1
SCL  (via drill 0.35)
  Top 0.305: IC1.20 48.26,52.07
  Top 0.406: 48.26,52.07 50.8,52.07
  Top 0.508: 50.8,52.07 54.61,48.26 v54.61,40.64
  Bottom 0.508: JP2.2 49.53,38.1 50.8,39.37 52.07,39.37 53.34,40.64 v54.61,40.64 U2.8
SCL$1  (via drill 0.35)
  Top 0.406: 44.45,69.85 48.26,66.04 IC1.1
  Top 0.508: 44.45,69.85 11.43,69.85 6.35,64.77 6.35,54.61 v7.62,53.34
  Bottom 0.508: v7.62,53.34 12.66,53.34 U1.5
SDA  (via drill 0.35)
  Top 0.406: 46.96,48.29 IC1.18
  Top 0.508: v49.53,43.18 49.53,45.72 46.96,48.29
  Bottom 0.508: U2.7 v49.53,43.18
SDA$1  (via drill 0.35)
  Top 0.305: 46.99,58.45 IC1.3
  Top 0.406: IC1.3 46.96,62.9 42.55,67.31
  Top 0.508: 42.55,67.31 16.51,67.31 15.24,66.04 v15.24,64.77
  Bottom 0.508: U1.3 8.92,55.85 7.62,57.15 7.62,62.23 10.16,64.77 v15.24,64.77
SW1-POWER  (via drill 0.35)
  Top 0.508: v35.56,27.94 R14.1 R18.2
  Bottom 0.508: v35.56,27.94 35.56,19.05 43.18,11.43 72.39,11.43 74.93,13.97 74.93,16.51 76.2,17.78 J5.2
SW2-CCW  (via drill 0.35)
  Top 0.508: R15.1 v33.02,27.94
  Bottom 0.508: J6.2 64.77,8.89 63.5,10.16 41.91,10.16 33.02,19.05 v33.02,27.94
SW3-BRAKE  (via drill 0.35)
  Top 0.508: v30.48,27.94 R16.1
  Bottom 0.508: v30.48,27.94 30.48,19.05 40.64,8.89 53.34,8.89 54.61,7.62 J7.2
SW4-CW  (via drill 0.35)
  Top 0.508: R17.1 26.67,19.05 v30.48,15.24
  Bottom 0.508: v30.48,15.24 31.75,15.24 39.37,7.62 43.18,7.62 44.45,6.35 J8.2

### Text on the board
Document: Rotor v1.01